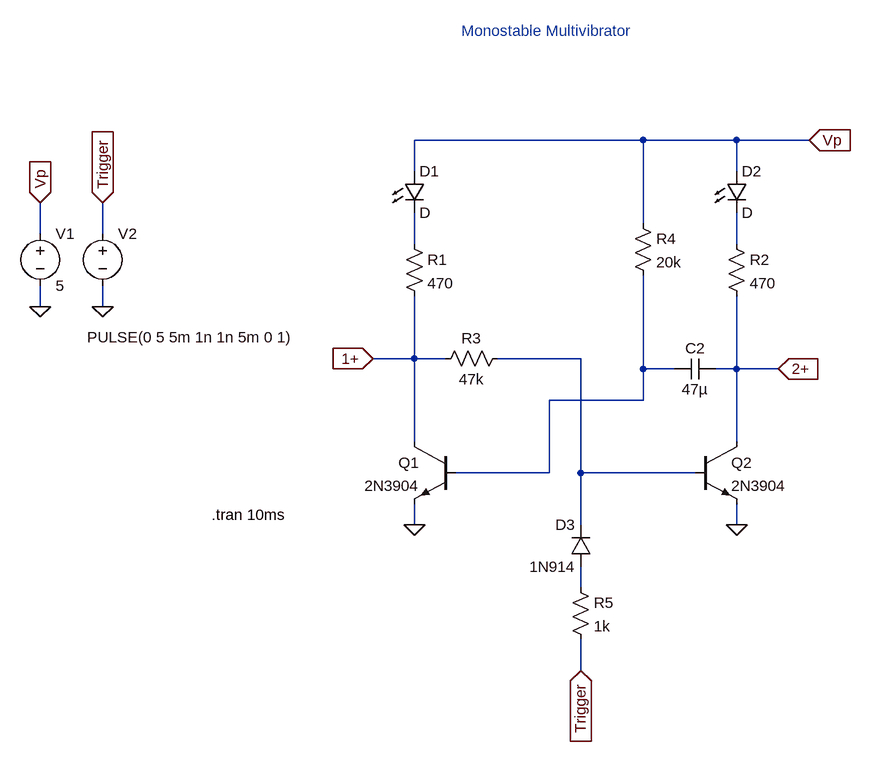
[diagram p0: schematic monostable_multivib_ltspice.asc]
monostable_multivib_ltspice.asc, the LTspice schematic file:
Version 4
SHEET 1 880 680
WIRE 448 -608 96 -608
WIRE 592 -608 448 -608
WIRE 704 -608 592 -608
WIRE 96 -560 96 -608
WIRE 592 -560 592 -608
WIRE 448 -480 448 -608
WIRE -480 -464 -480 -512
WIRE -384 -464 -384 -512
WIRE 96 -448 96 -496
WIRE 592 -448 592 -496
WIRE -480 -352 -480 -384
WIRE -384 -352 -384 -384
WIRE 96 -272 96 -368
WIRE 96 -272 32 -272
WIRE 144 -272 96 -272
WIRE 352 -272 224 -272
WIRE 448 -256 448 -400
WIRE 496 -256 448 -256
WIRE 592 -256 592 -368
WIRE 592 -256 560 -256
WIRE 656 -256 592 -256
WIRE 448 -208 448 -256
WIRE 448 -208 304 -208
WIRE 96 -144 96 -272
WIRE 592 -144 592 -256
WIRE 304 -96 304 -208
WIRE 304 -96 160 -96
WIRE 352 -96 352 -272
WIRE 528 -96 352 -96
WIRE 96 -16 96 -48
WIRE 352 -16 352 -96
WIRE 592 -16 592 -48
WIRE 352 80 352 48
WIRE 352 208 352 160
FLAG 96 -16 0
FLAG 592 -16 0
FLAG 704 -608 Vp
IOPIN 704 -608 In
FLAG 32 -272 1+
IOPIN 32 -272 In
FLAG 656 -256 2+
IOPIN 656 -256 In
FLAG -480 -352 0
FLAG -480 -512 Vp
IOPIN -480 -512 In
FLAG 352 208 Trigger
IOPIN 352 208 In
FLAG -384 -352 0
FLAG -384 -512 Trigger
IOPIN -384 -512 In
SYMBOL npn 160 -144 M0
SYMATTR InstName Q1
SYMATTR Value 2N3904
SYMBOL npn 528 -144 R0
SYMATTR InstName Q2
SYMATTR Value 2N3904
SYMBOL res 80 -464 R0
SYMATTR InstName R1
SYMATTR Value 470
SYMBOL res 576 -464 R0
SYMATTR InstName R2
SYMATTR Value 470
SYMBOL res 432 -496 R0
SYMATTR InstName R4
SYMATTR Value 20k
SYMBOL cap 560 -272 R90
WINDOW 0 0 32 VBottom 2
WINDOW 3 32 32 VTop 2
SYMATTR InstName C2
SYMATTR Value 47µ
SYMBOL LED 80 -560 R0
SYMATTR InstName D1
SYMBOL LED 576 -560 R0
SYMATTR InstName D2
SYMBOL voltage -480 -480 R0
WINDOW 123 0 0 Left 0
WINDOW 39 0 0 Left 0
SYMATTR InstName V1
SYMATTR Value 5
SYMBOL diode 368 48 R180
WINDOW 0 24 64 Left 2
WINDOW 3 24 0 Left 2
SYMATTR InstName D3
SYMATTR Value 1N914
SYMBOL res 336 64 R0
SYMATTR InstName R5
SYMATTR Value 1k
SYMBOL res 240 -288 R90
WINDOW 0 0 56 VBottom 2
WINDOW 3 32 56 VTop 2
SYMATTR InstName R3
SYMATTR Value 47k
SYMBOL voltage -384 -480 R0
WINDOW 3 -24 175 Left 2
WINDOW 123 0 0 Left 0
WINDOW 39 0 0 Left 0
SYMATTR InstName V2
SYMATTR Value PULSE(0 5 5m 1n 1n 5m 0 1)
TEXT -216 -32 Left 2 !.tran 10ms
TEXT 168 -776 Left 2 ;Monostable Multivibrator

The netlist it stands for:
* monostable_multivib_ltspice.asc
Q1 1+ N004 0 0 2N3904
Q2 2+ N003 0 0 2N3904
R1 N001 1+ 470
R2 N002 2+ 470
R4 Vp N004 20k
C2 2+ N004 47µ
D1 Vp N001 D
D2 Vp N002 D
V1 Vp 0 5
D3 N005 N003 1N914
R5 N005 Trigger 1k
R3 N003 1+ 47k
V2 Trigger 0 PULSE(0 5 5m 1n 1n 5m 0 1)
.model D D
.lib standard.dio
.model NPN NPN
.model PNP PNP
.lib standard.bjt
.tran 10ms
* Monostable Multivibrator
.backanno
.end